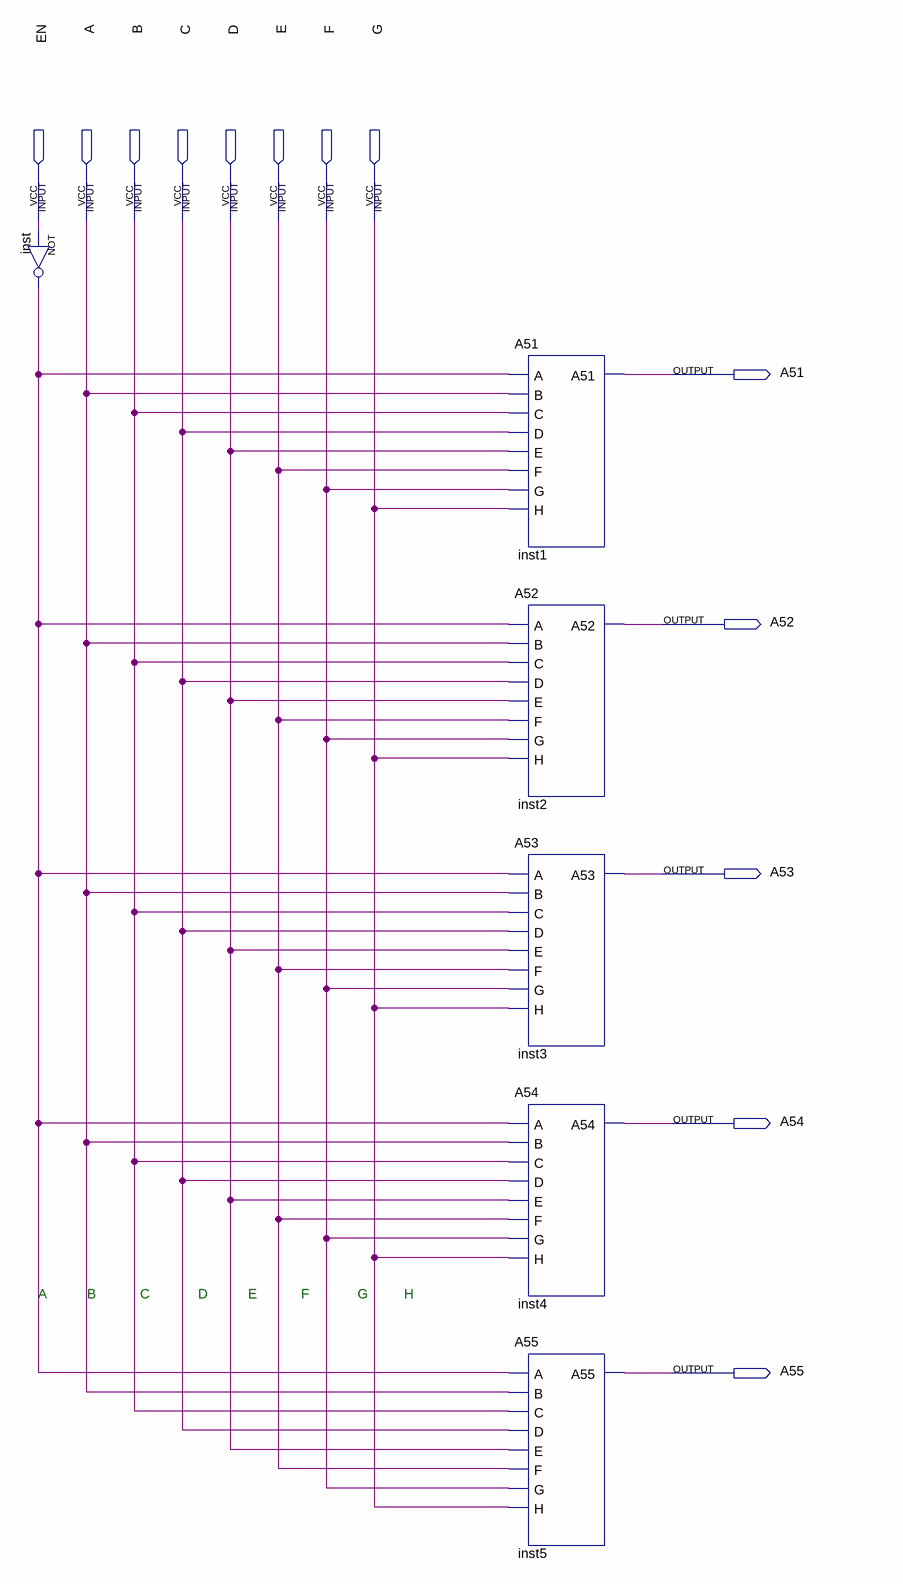
[diagram p0: schematic sheet]
// Quartus schematic Linha5.bdf as structural Verilog: 6 symbols, 13 pins
module Linha5 (
  input  EN,
  input  A,
  input  B,
  input  C,
  input  D,
  input  E,
  input  F,
  input  G,
  output A51,
  output A52,
  output A53,
  output A54,
  output A55
);

  wire inst_out;

  not inst (inst_out, EN);
  A51 inst1 (.A(inst_out), .B(A), .C(B), .D(C), .E(D), .F(E), .G(F), .H(G), .A51(A51));
  A52 inst2 (.A(inst_out), .B(A), .C(B), .D(C), .E(D), .F(E), .G(F), .H(G), .A52(A52));
  A53 inst3 (.A(inst_out), .B(A), .C(B), .D(C), .E(D), .F(E), .G(F), .H(G), .A53(A53));
  A54 inst4 (.A(inst_out), .B(A), .C(B), .D(C), .E(D), .F(E), .G(F), .H(G), .A54(A54));
  A55 inst5 (.A(inst_out), .B(A), .C(B), .D(C), .E(D), .F(E), .G(F), .H(G), .A55(A55));

  // Notes on the sheet:
  //   A          B           C            D          E           F            G         H
endmodule
